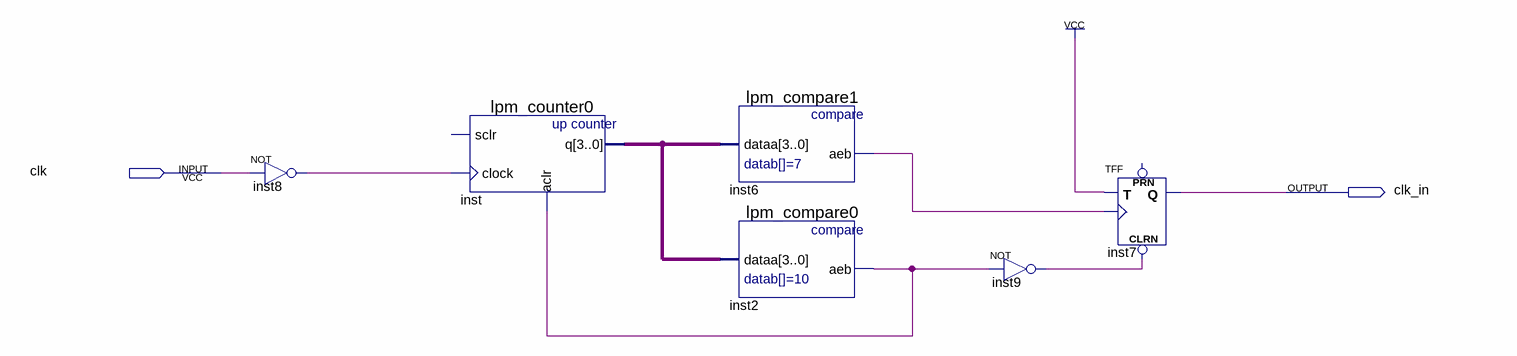
[diagram p0: schematic sheet]
// Quartus schematic Block1.bdf as structural Verilog: 6 symbols, 2 pins
module Block1 (
  input  clk,
  output clk_in
);

  wire inst2_aeb, inst6_aeb, inst8_out, inst9_out;
  wire [3:0] inst_q;

  not inst8 (inst8_out, clk);
  lpm_counter0 inst (.clock(inst8_out), .aclr(inst2_aeb), .q(inst_q));  // open: sclr
  lpm_compare1 inst6 (.dataa(inst_q), .aeb(inst6_aeb));
  lpm_compare0 inst2 (.dataa(inst_q), .aeb(inst2_aeb));
  not inst9 (inst9_out, inst2_aeb);
  TFF inst7 (.CLRN(inst9_out), .T(1'b1), .CLK(inst6_aeb), .Q(clk_in));  // open: PRN
endmodule
